# Altium schematic sheet light_sensor.SchDoc
size A4
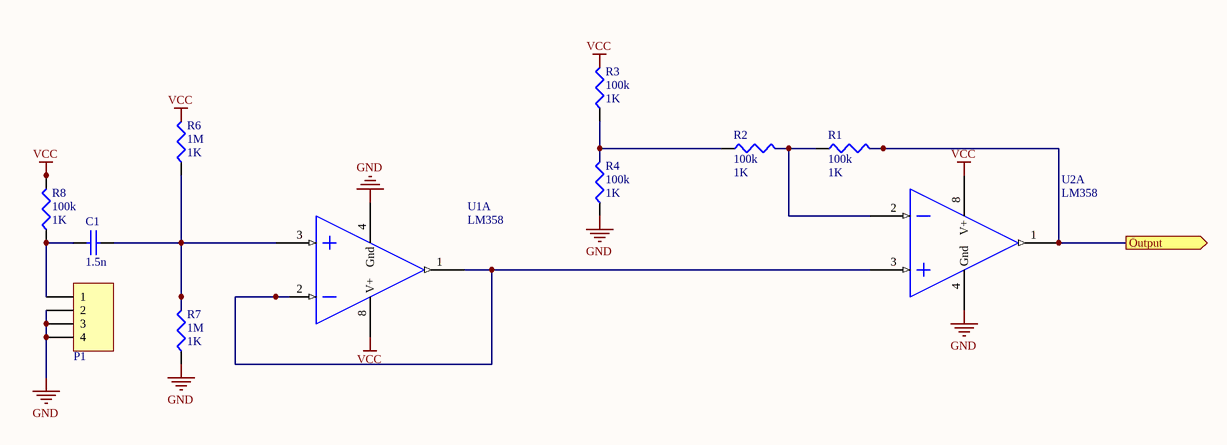
[diagram p0: light_sensor.SchDoc]

## Parts
C1  1.5n  [ECE-CAPR0.2x0.1TH]
P1  Phototransistor  [ECE-600104STTH]  (value not drawn)
R1  100k  value 1K  [J1-0603]
R2  100k  value 1K  [J1-0603]
R3  100k  value 1K  [J1-0603]
R4  100k  value 1K  [J1-0603]
R6  1M  value 1K  [J1-0603]
R7  1M  value 1K  [J1-0603]
R8  100k  value 1K  [J1-0603]
U1  LM358  [ECE-DIP8TH]  (part A of 2)
U2  LM358  [ECE-DIP8TH]  (part A of 2)

## Ports
Output (out)

## Nets
GND: P1.2 P1.3 P1.4 R4.1 R7.1 U1.4(Gnd) U2.4(Gnd)
VCC: R8.2 U1.8(V+) U2.8(V+)
Output: R1.2 U2.1(OUT1) ; port Output
NetC1_1: C1.1 R6.1 R7.2 U1.3(IN1(+))
NetC1_2: C1.2 P1.1 R8.1
NetR1_1: R1.1 R2.2 U2.2(IN1(-))
NetR2_1: R2.1 R3.1 R4.2
NetU1_1: U1.1(OUT1) U1.2(IN1(-)) U2.3(IN1(+))

Not connected (* = marked no-connect by the designer): R3 2; R6 2

## Notes on the sheet
- Labels drawn without touching a wire or pin: VCC

## Library data of the parts
C1 = CAP000001: CAP CER 10pF 50V TH; Manufactuer: TDK; Manufacturer-PN: FK28C0G1H100D; Assembly Method: Through hole; Item Type: Item; Path: ece/ts/Lists/Stock Inventory; Value: 10pF; UoA Stock#: CAP000001; Size/Package: Radial; Voltage/Current: 50V; Datasheet Link: http://share.engineering.auckland.ac.nz/ece/ts/Student%20Documents/CER%20CAP.pdf; Supplier1: Electus; Supplier1-PN: RC5312; Component Type: NA; Category: Capacitor; Review-date: 41972; Status: Active
P1 = CON000003: HEADER POLARISED 4WAY TH; Manufactuer: GTK; Manufacturer-PN: 600104ST; Assembly Method: Through hole; Item Type: Item; Path: ece/ts/Lists/Stock Inventory; UoA Stock#: CON000003; Value: 4 Way; Size/Package: 2.54 Radial; Datasheet Link: http://share.engineering.auckland.ac.nz/ece/ts/Student%20Documents/polarised_connectors.pdf; Supplier1: Elecon; Supplier1-PN: YY3N04; Supplier2: Active Components; Supplier2-PN: 600104ST; Component Type: NA; Category: Connector; Status: Active
R1-R4 R6-R8 = Res3: Resistor; Published: 8-Jun-2000; LatestRevisionDate: 29-May-2009; LatestRevisionNote: IPC-7351 Footprint Added.; PackageReference: J1-0603; Publisher: Altium Limited; PackageDescription: Chip Resistor
U1 U2 = OPA000005: IC OPAMP LM358 DUAL TH; Manufactuer: Fairchild; Manufacturer-PN: LM358N; Assembly Method: Through hole; Item Type: Item; Path: ece/ts/Lists/Stock Inventory; UoA Stock#: OPA000005; Value: LM358; Size/Package: DIP8; Datasheet Link: http://share.engineering.auckland.ac.nz/ece/ts/Student%20Documents/LM358.pdf; Supplier1: Digikey; Supplier1-PN: LM358NFS-ND; Supplier2: Active Components; Supplier2-PN: LM358N; Category: OpAmp; Status: Active